# Altium schematic sheet Zasilanie.SchDoc
size A4
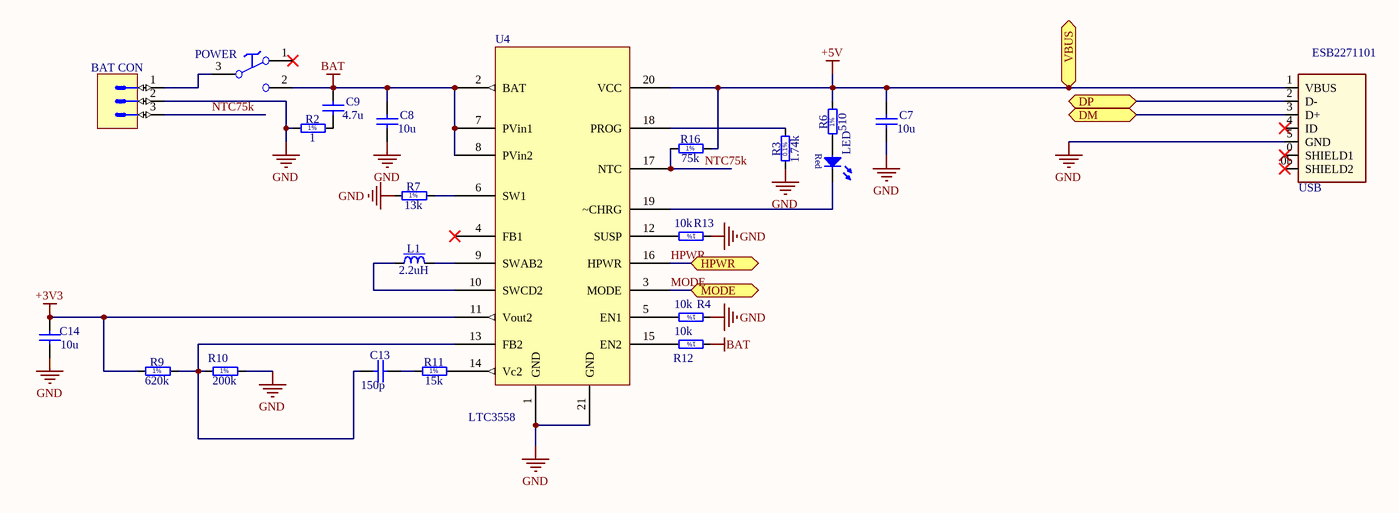
[diagram p0: Zasilanie.SchDoc]

## Parts
BAT_CON  KK®  [MOLEX_22-05-7038]  (value not drawn)
C7  10u  [CAPC2012X135N]
C8  10u  [CAPC2012X135N]
C9  4.7u  [CAPC1608X87N]
C13  150p  [CAPC1005X55N]
C14  10u  [CAPC2012X135N]
L1  2.2uH  [IND_WURTH_WE-TPC_4828]
LED  Red  [LED_AVAGO_HSMC-C150]  (value not drawn)
POWER  Switch  [SW_MENTOR_1850]  (value not drawn)
R2  1  [RESC1005X40N]
R3  1.74k  [RESC1608X55N]
R4  10k  [RESC1005X40N]
R6  510  [RESC1005X40N]
R7  13k  [RESC1005X40N]
R9  620k  [RESC1005X40N]
R10  200k  [RESC1005X40N]
R11  15k  [RESC1005X40N]
R12  10k  [RESC1005X40N]
R13  10k  [RESC1005X40N]
R16  75k  [RESC1005X40N]
U4  LTC3558  [LTC3558nowe2]
USB  ESB2271101  [USB_MICRO_ESB2271101]

## Ports
DM, DP, HPWR, MODE, VBUS

## Nets
+3V3: C14.1 R9.1 U4.11(Vout2)
+5V: C7.1 R6.2 R16.2 U4.20(VCC) USB.1(VBUS) ; port VBUS
BAT: C8.1 C9.1 POWER.2 R12.1 U4.2(BAT) U4.7(PVin1) U4.8(PVin2)
GND: BAT_CON.2 C7.2 C8.2 C14.2 R2.1 R3.1 R4.1 R7.1 R10.2 R13.1 U4.1(GND) U4.21(GND) USB.5(GND)
DM: USB.3(D+) ; port DM
DP: USB.2(D-) ; port DP
HPWR: U4.16(HPWR) ; port HPWR
MODE: U4.3(MODE) ; port MODE
NTC75k: BAT_CON.3 R16.1 U4.17(NTC)
NetBAT_CON_1: BAT_CON.1 POWER.3
NetC9_2: C9.2 R2.2
NetC13_1: C13.1 R9.2 R10.1 U4.13(FB2)
NetC13_2: C13.2 R11.1
NetL1_1: L1.1 U4.10(SWCD2)
NetL1_2: L1.2 U4.9(SWAB2)
NetLED_1: LED.1(C) U4.19(~CHRG)
NetLED_2: LED.2(A) R6.1
NetR3_2: R3.2 U4.18(PROG)
NetR4_2: R4.2 U4.5(EN1)
NetR7_2: R7.2 U4.6(SW1)
NetR11_2: R11.2 U4.14(Vc2)
NetR12_2: R12.2 U4.15(EN2)
NetR13_2: R13.2 U4.12(SUSP)
NetUSB_0: USB.0(SHIELD1) USB.0a(SHIELD1)
NetUSB_0b: USB.0b(SHIELD2) USB.0c(SHIELD2)

Not connected (* = marked no-connect by the designer): POWER 1*; U4 4(FB1)*; USB 4(ID)*

## Notes on the sheet
- (in symbol R0402_1R_1%_0.0625W_200PPM) 1%
- (in symbol R0402_10K_1%_0.0625W_100PPM) 1%
- (in symbol R0402_13K_1%_0.0625W_100PPM) 1%
- (in symbol R0402_75K_1%_0.0625W_100PPM) 1%
- (in symbol R0402_200K_1%_0.0625W_100PPM) 1%
- (in symbol R0402_510R_1%_0.0625W_100PPM) 1%
- (in symbol R0402_620R_1%_0.0625W_100PPM) 1%
- (in symbol R0603_1K74_0.1%_0.063W_10PPM) 0.1%

## Library data of the parts
BAT_CON = MOLEX_22-05-7038: Connector 3 Male; Part Description: 2.54mm (.100") Pitch KK® Wire-To-Board Header, Right Angle, With Friction Lock, 3 Circuits; Manufacturer: MOLEX; Part Number: MOLEX_22-05-7038; Component Kind: Standard; Component Type: Standard; Pin Count: 3; Family: KK®; Mounted: Yes; Socket: No; SMD: No; Status: None; Manufacturer Part Number: 22-05-7038; ComponentHeight: 5.8mm; HelpURL: \\cern.ch\dfs\Applications\Altium\Datasheets\MOLEX_22-05-7038.pdf; Author: CERN DEM JLC; CreateDate: 2012-09-19; LatestRevisionDate: 2012-09-19; Table: MOLEX
C7 C8 C14 = CC0805_10UF_16V_10%_X5R: Non-polarised capacitor; Part Description: SMD Multilayer Chip Ceramic Capacitor; Manufacturer: GENERIC; Manufacturer1 Part Number: C0805C106K4PAC; Value: 10uF; Voltage: 16V; TC: X5R; Tolerance: ±10%; Table: Capacitors SMD; Part Number: CC0805_10UF_16V_10%_X5R; Component Kind: Standard; Component Type: Standard; Pin Count: 2; Status: Preferred; Manufacturer Part Number: CC0805_10UF_16V_10%_X5R; Case: 0805; Mounted: Yes; Socket: No; SMD: Yes; Manufacturer1 Example: KEMET; Manufacturer1 ComponentHeight: 1.4mm; HelpURL: \\cern.ch\dfs\Applications\Altium\Datasheets\CC1206_X5R_KEMET.pdf; Author: CERN DEM JLC; CreateDate: 2007-12-03; LatestRevisionDate: 2007-12-03
C9 = CC0603_4.7UF_6.3V_10%_X5R: Non-polarised capacitor; Part Description: SMD Multilayer Chip Ceramic Capacitor; Manufacturer: GENERIC; Manufacturer1 Part Number: 225520613672; Value: 4.7uF; Voltage: 6.3V; TC: X5R; Tolerance: ±10%; Table: Capacitors SMD; Part Number: CC0603_4.7UF_6.3V_10%_X5R; Component Kind: Standard; Component Type: Standard; Pin Count: 2; Status: Preferred; Manufacturer Part Number: CC0603_4.7uF_6.3V_10%_X5R; Case: 0603; Mounted: Yes; Socket: No; SMD: Yes; Manufacturer1 Example: PHYCOMP; Manufacturer1 ComponentHeight: 0.87mm; HelpURL: \\cern.ch\dfs\Applications\Altium\Datasheets\CC0805_X5R_PHYCOMP_HC.pdf; Author: CERN DEM JLC; CreateDate: 2007-12-03; LatestRevisionDate: 2007-12-03
C13 = CC0402_150PF_50V_5%_NP0: Non-polarised capacitor; Part Description: SMD Multilayer Chip Ceramic Capacitor; Manufacturer: GENERIC; Manufacturer1 Part Number: 223886915151; Value: 150pF; Voltage: 50V; TC: NP0; Tolerance: ±5%; Table: Capacitors SMD; Part Number: CC0402_150PF_50V_5%_NP0; Component Kind: Standard; Component Type: Standard; Pin Count: 2; Status: Not Recommended; Manufacturer Part Number: CC0402_150PF_50V_5%_NP0; Case: 0402; Mounted: Yes; Socket: No; SMD: Yes; Manufacturer1 Example: PHYCOMP; Manufacturer1 ComponentHeight: 0.55mm; HelpURL: \\cern.ch\dfs\Applications\Altium\Datasheets\CC0402_NP0_PHYCOMP.pdf; Author: CERN DEM JLC; CreateDate: 2007-12-03; LatestRevisionDate: 2007-12-03
L1 = IND_2.2UH_30%_WURTH_WE-TPC_7440430022: Inductor With Magnetic core; Part Description: Shielded Tiny Power Inductor (WE-TPC Serie); Manufacturer: WURTH ELEKTRONIK; Power: 2.5A; Resistance: 0.023R; Tolerance: ±30%; Table: Inductors SMD; Part Number: IND_2.2UH_30%_WURTH_WE-TPC_7440430022; Component Kind: Standard; Component Type: Standard; Pin Count: 2; Value: 2.2uH; Status: None; Manufacturer Part Number: 7440430022; Mounted: Yes; Socket: No; SMD: Yes; ComponentHeight: 3mm; HelpURL: \\cern.ch\dfs\Applications\Altium\Datasheets\IND_WURTH_WE-TPC_7440430022.pdf; Author: CERN DEM JLC; CreateDate: 2012-11-19; LatestRevisionDate: 2012-11-19
LED = LED_AVAGO_HSMC-C150: LED Red 1C 2A; Part Description: Surface Mount Red LED (1206 Case); Manufacturer: AVAGO TECHNOLOGIES; Table: LEDs & Displays; Part Number: LED_AVAGO_HSMC-C150; Component Kind: Standard; Component Type: Standard; Color: Red; PackageDescription: Red Chip LED, 2-Leads, Body 3.2 x1.6mm, IPC Medium Density; Manufacturer Part Number: HSMC-C150; Pin Count: 2; Case: 1206; Mounted: Yes; Socket: No; SMD: Yes; ComponentHeight: 1.2mm; HelpURL: \\cern.ch\dfs\Applications\Altium\Datasheets\LED_AVAGO_HSMC-C150.pdf; Author: CERN DEM JLC; CreateDate: 2013-06-18; LatestRevisionDate: 2013-06-18
POWER = SW_MENTOR_1850.1031: SPDT Switch; Part Description: SPDT Toggle Switch - PCB Edge Mounting; Manufacturer: MENTOR; SCEM: 07.88.10.140.4; Table: Switches; Part Number: SW_MENTOR_1850.1031; Component Kind: Standard; Component Type: Standard; Pin Count: 3; PackageDescription: SPDT Switch - PCB Edge Mounting - MENTOR_1850; Family: Switch; Mounted: Yes; Socket: No; SMD: No; Status: None; Manufacturer Part Number: 1850.1031; ComponentHeight: 9.95mm; HelpURL: \\cern.ch\dfs\Applications\Altium\Datasheets\SW_MENTOR_1850.1031.pdf; Author: CERN DEM JMW; CreateDate: 2008-10-03; LatestRevisionDate: 2008-10-03
R2 = R0402_1R_1%_0.0625W_200PPM: Resistor - 1%; Part Description: General Purpose Thick Film Chip Resistor; Manufacturer: GENERIC; Manufacturer1 Part Number: 232270671008; TC: ±200ppm/°C; Table: Resistors SMD; Part Number: R0402_1R_1%_0.0625W_200PPM; Component Kind: Standard; Component Type: Standard; Pin Count: 2; Value: 1; Status: Not recommended; Power: 0.0625W; Tolerance: ±1%; Manufacturer Part Number: R0402_1R_1%_0.0625W_200PPM; Case: 0402; Mounted: Yes; Socket: No; SMD: Yes; Manufacturer1 Example: PHYCOMP; Manufacturer1 ComponentHeight: 0.4mm; HelpURL: \\cern.ch\dfs\Applications\Altium\Datasheets\R0402_Phycomp_RC0402.pdf; Author: CERN DEM JLC; CreateDate: 2007-12-03; LatestRevisionDate: 2009-06-24
R3 = R0603_1K74_0.1%_0.063W_10PPM: Resistor - 0.1%; Part Description: Thin Film Chip Resistor; Manufacturer: GENERIC; Manufacturer1 Part Number: RN73C1J1K74BTDF; Value: 1k74; Power: 0.063W; TC: ±10ppm; Table: Resistors SMD; Part Number: R0603_1K74_0.1%_0.063W_10PPM; Component Kind: Standard; Component Type: Standard; Pin Count: 2; Status: Not recommended; Tolerance: ±0.1%; Manufacturer Part Number: R0603_1K74_0.1%_0.063W_10PPM; Case: 0603; Mounted: Yes; Socket: No; SMD: Yes; Manufacturer1 Example: TYCO HOLSWORTHY; Manufacturer1 ComponentHeight: 0.5mm; HelpURL: \\cern.ch\dfs\Applications\Altium\Datasheets\R0603_Tyco_RN73.pdf; Author: CERN DEM JLC; CreateDate: 2007-12-03; LatestRevisionDate: 2008-03-13
R4 R11-R13 = R0402_10K_1%_0.0625W_100PPM: Resistor - 1%; Part Description: General Purpose Thick Film Chip Resistor; Manufacturer: GENERIC; Manufacturer1 Part Number: 232270671003; TC: ±100ppm/°C; Table: Resistors SMD; Part Number: R0402_10K_1%_0.0625W_100PPM; Component Kind: Standard; Component Type: Standard; Pin Count: 2; Status: Not recommended; Power: 0.0625W; Tolerance: ±1%; Manufacturer Part Number: R0402_10K_1%_0.0625W_100PPM; Case: 0402; Mounted: Yes; Socket: No; SMD: Yes; Manufacturer1 Example: PHYCOMP; Manufacturer1 ComponentHeight: 0.4mm; HelpURL: \\cern.ch\dfs\Applications\Altium\Datasheets\R0402_Phycomp_RC0402.pdf; Author: CERN DEM JLC; CreateDate: 2007-12-03; LatestRevisionDate: 2008-03-13
  R4 R12 R13: Value: 10k
  R11: Value: 15k
R6 = R0402_510R_1%_0.0625W_100PPM: Resistor - 1%; Part Description: General Purpose Thick Film Chip Resistor; Manufacturer: GENERIC; Manufacturer1 Part Number: 232270675101; TC: ±100ppm/°C; Table: Resistors SMD; Part Number: R0402_510R_1%_0.0625W_100PPM; Component Kind: Standard; Component Type: Standard; Pin Count: 2; Value: 510; Status: Not recommended; Power: 0.0625W; Tolerance: ±1%; Manufacturer Part Number: R0402_510R_1%_0.0625W_100PPM; Case: 0402; Mounted: Yes; Socket: No; SMD: Yes; Manufacturer1 Example: PHYCOMP; Manufacturer1 ComponentHeight: 0.4mm; HelpURL: \\cern.ch\dfs\Applications\Altium\Datasheets\R0402_Phycomp_RC0402.pdf; Author: CERN DEM JLC; CreateDate: 2007-12-03; LatestRevisionDate: 2008-03-13
R7 = R0402_13K_1%_0.0625W_100PPM: Resistor - 1%; Part Description: General Purpose Thick Film Chip Resistor; Manufacturer: GENERIC; Manufacturer1 Part Number: 232270671303L; TC: ±100ppm/°C; Table: Resistors SMD; Part Number: R0402_13K_1%_0.0625W_100PPM; Component Kind: Standard; Component Type: Standard; Pin Count: 2; Value: 13k; Status: Not recommended; Power: 0.0625W; Tolerance: ±1%; Manufacturer Part Number: R0402_13K_1%_0.0625W_100PPM; Case: 0402; Mounted: Yes; Socket: No; SMD: Yes; Manufacturer1 Example: YAGEO PHYCOMP; Manufacturer1 ComponentHeight: 0.4mm; HelpURL: \\cern.ch\dfs\Applications\Altium\Datasheets\R0402_Phycomp_RC0402.pdf; Author: CERN DEM JLC; CreateDate: 2007-12-03; LatestRevisionDate: 2012-10-17
R9 = R0402_620R_1%_0.0625W_100PPM: Resistor - 1%; Part Description: General Purpose Thick Film Chip Resistor; Manufacturer: GENERIC; Manufacturer1 Part Number: 232270676201L; Value: 620; TC: ±100ppm/°C; Table: Resistors SMD; Part Number: R0402_620R_1%_0.0625W_100PPM; Component Kind: Standard; Component Type: Standard; Pin Count: 2; Status: Not recommended; Power: 0.0625W; Tolerance: ±1%; Manufacturer Part Number: R0402_620R_1%_0.0625W_100PPM; Case: 0402; Mounted: Yes; Socket: No; SMD: Yes; Manufacturer1 Example: YAGEO PHYCOMP; Manufacturer1 ComponentHeight: 0.4mm; HelpURL: \\cern.ch\dfs\Applications\Altium\Datasheets\R0402_Phycomp_RC0402.pdf; Author: CERN DEM JLC; CreateDate: 2007-12-03; LatestRevisionDate: 2012-10-17
R10 = R0402_200K_1%_0.0625W_100PPM: Resistor - 1%; Part Description: General Purpose Thick Film Chip Resistor; Manufacturer: GENERIC; Manufacturer1 Part Number: 232270672004L; TC: ±100ppm/°C; Table: Resistors SMD; Part Number: R0402_200K_1%_0.0625W_100PPM; Component Kind: Standard; Component Type: Standard; Pin Count: 2; Value: 200k; Status: Not recommended; Power: 0.0625W; Tolerance: ±1%; Manufacturer Part Number: R0402_200K_1%_0.0625W_100PPM; Case: 0402; Mounted: Yes; Socket: No; SMD: Yes; Manufacturer1 Example: YAGEO PHYCOMP; Manufacturer1 ComponentHeight: 0.4mm; HelpURL: \\cern.ch\dfs\Applications\Altium\Datasheets\R0402_Phycomp_RC0402.pdf; Author: CERN DEM JLC; CreateDate: 2007-12-03; LatestRevisionDate: 2012-10-17
R16 = R0402_75K_1%_0.0625W_100PPM: Resistor - 1%; Part Description: General Purpose Thick Film Chip Resistor; Manufacturer: GENERIC; Manufacturer1 Part Number: 232270677503L; TC: ±100ppm/°C; Table: Resistors SMD; Part Number: R0402_75K_1%_0.0625W_100PPM; Component Kind: Standard; Component Type: Standard; Pin Count: 2; Value: 75k; Status: Not recommended; Power: 0.0625W; Tolerance: ±1%; Manufacturer Part Number: R0402_75K_1%_0.0625W_100PPM; Case: 0402; Mounted: Yes; Socket: No; SMD: Yes; Manufacturer1 Example: YAGEO PHYCOMP; Manufacturer1 ComponentHeight: 0.4mm; HelpURL: \\cern.ch\dfs\Applications\Altium\Datasheets\R0402_Phycomp_RC0402.pdf; Author: CERN DEM JLC; CreateDate: 2007-12-03; LatestRevisionDate: 2012-10-17
U4 = LTC3558: USB Buck-Boost Charger
USB = CON_USB_AB_MICRO: USB micro AB connector; Part Number: 10133; Device: USB_Mini_AB